# Altium project OBD-II-ELM327.PrjPcb
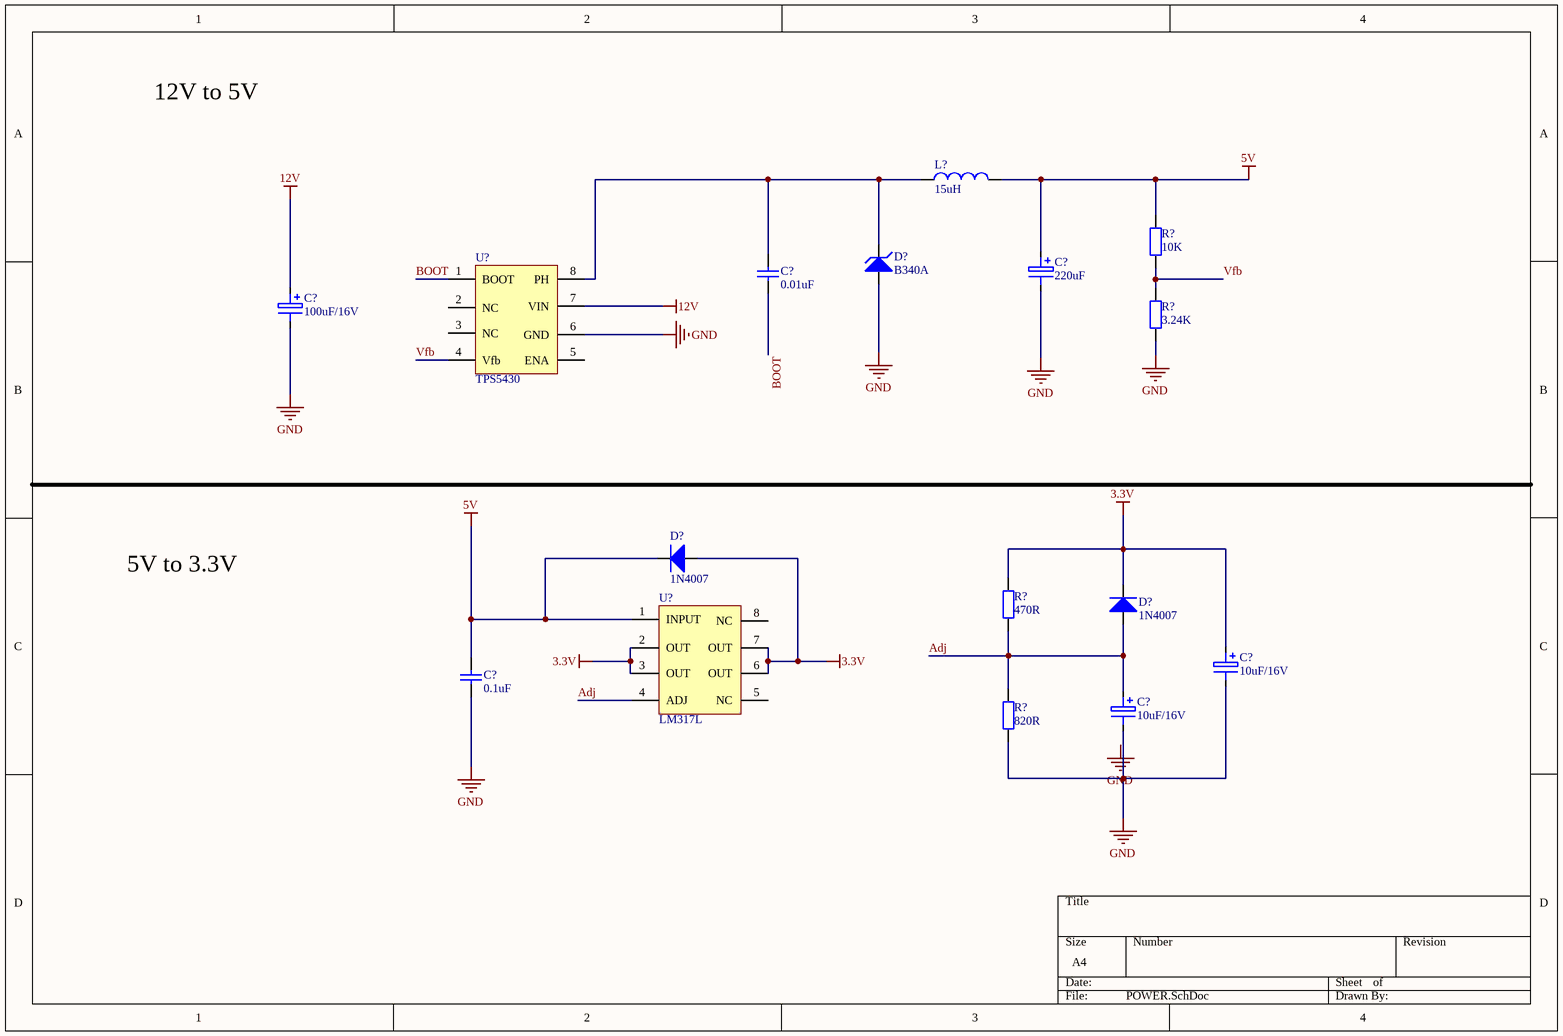
[diagram p0: POWER.SchDoc]
3 sheets, 47 parts. Net scope: global (net labels, ports and power ports of the same name join across sheets).
Board file: OBD-EML.PcbDoc
Sheets:
  POWER.SchDoc
  Core.SchDoc
  PL2303.SchDoc

## Sheet POWER.SchDoc
size A4

### Parts
(Parts that share a designator on the sheet are numbered #1, #2 ... from top to bottom, then left to right.)
C?#1  220uF  [CAPM-7.0*4.5]
C?#2  0.01uF  [0603]
C?#3  100uF/16V  [CAPM-7.0*4.5]
C?#4  10uF/16V  [CAPM-5.5*3.3]
C?#5  0.1uF  [0603]
C?#6  10uF/16V  [CAPM-5.5*3.3]
D?#1  B340A  [DO214-AC]
D?#2  1N4007  [DO214-AC]
D?#3  1N4007  [DO214-AC]
L?#1  15uH  [7*7*4-15uH]
R?#1  10K  [0603]
R?#2  3.24K  [0603]
R?#3  470R  [0603]
R?#4  820R  [0603]
U?#1  TPS5430  [TPS5430]
U?#2  LM317L  [LM317L]

### Nets
3.3V: C?#4.1 D?#2.1(A) D?#3.2(K) R?#3.2 U?#2.2(OUT) U?#2.3(OUT) U?#2.6(OUT) U?#2.7(OUT)
5V: C?#1.1 C?#5.2 D?#2.2(K) L?#1.2 R?#1.2 U?#2.1(INPUT)
12V: C?#3.1 U?#1.7(VIN)
GND: C?#1.2 C?#3.2 C?#4.2 C?#5.1 C?#6.2 D?#1.1(A) R?#2.1 R?#4.1 U?#1.6(GND)
Adj: C?#6.1 D?#3.1(A) R?#3.1 R?#4.2 U?#2.4(ADJ)
BOOT: C?#2.1 U?#1.1(BOOT)
Vfb: R?#1.1 R?#2.2 U?#1.4(Vfb)
NetC?#2_2: C?#2.2 D?#1.2(K) L?#1.1 U?#1.8(PH)

Not connected (* = marked no-connect by the designer): U?#1 2(NC) 3(NC) 5(ENA); U?#2 5(NC) 8(NC)

### Notes on the sheet
- 12V to 5V
- 5V to 3.3V
- Labels drawn without touching a wire or pin: GND

### Library data of the parts
C?#1 C?#3 C?#4 C?#6 = Cap3: aluminum
C?#2 C?#5 = Cap1: ceramic
D?#1 = B340A-13-F
L?#1 = Inductor
R?#1-R?#4 = Res

## Sheet Core.SchDoc
size A3
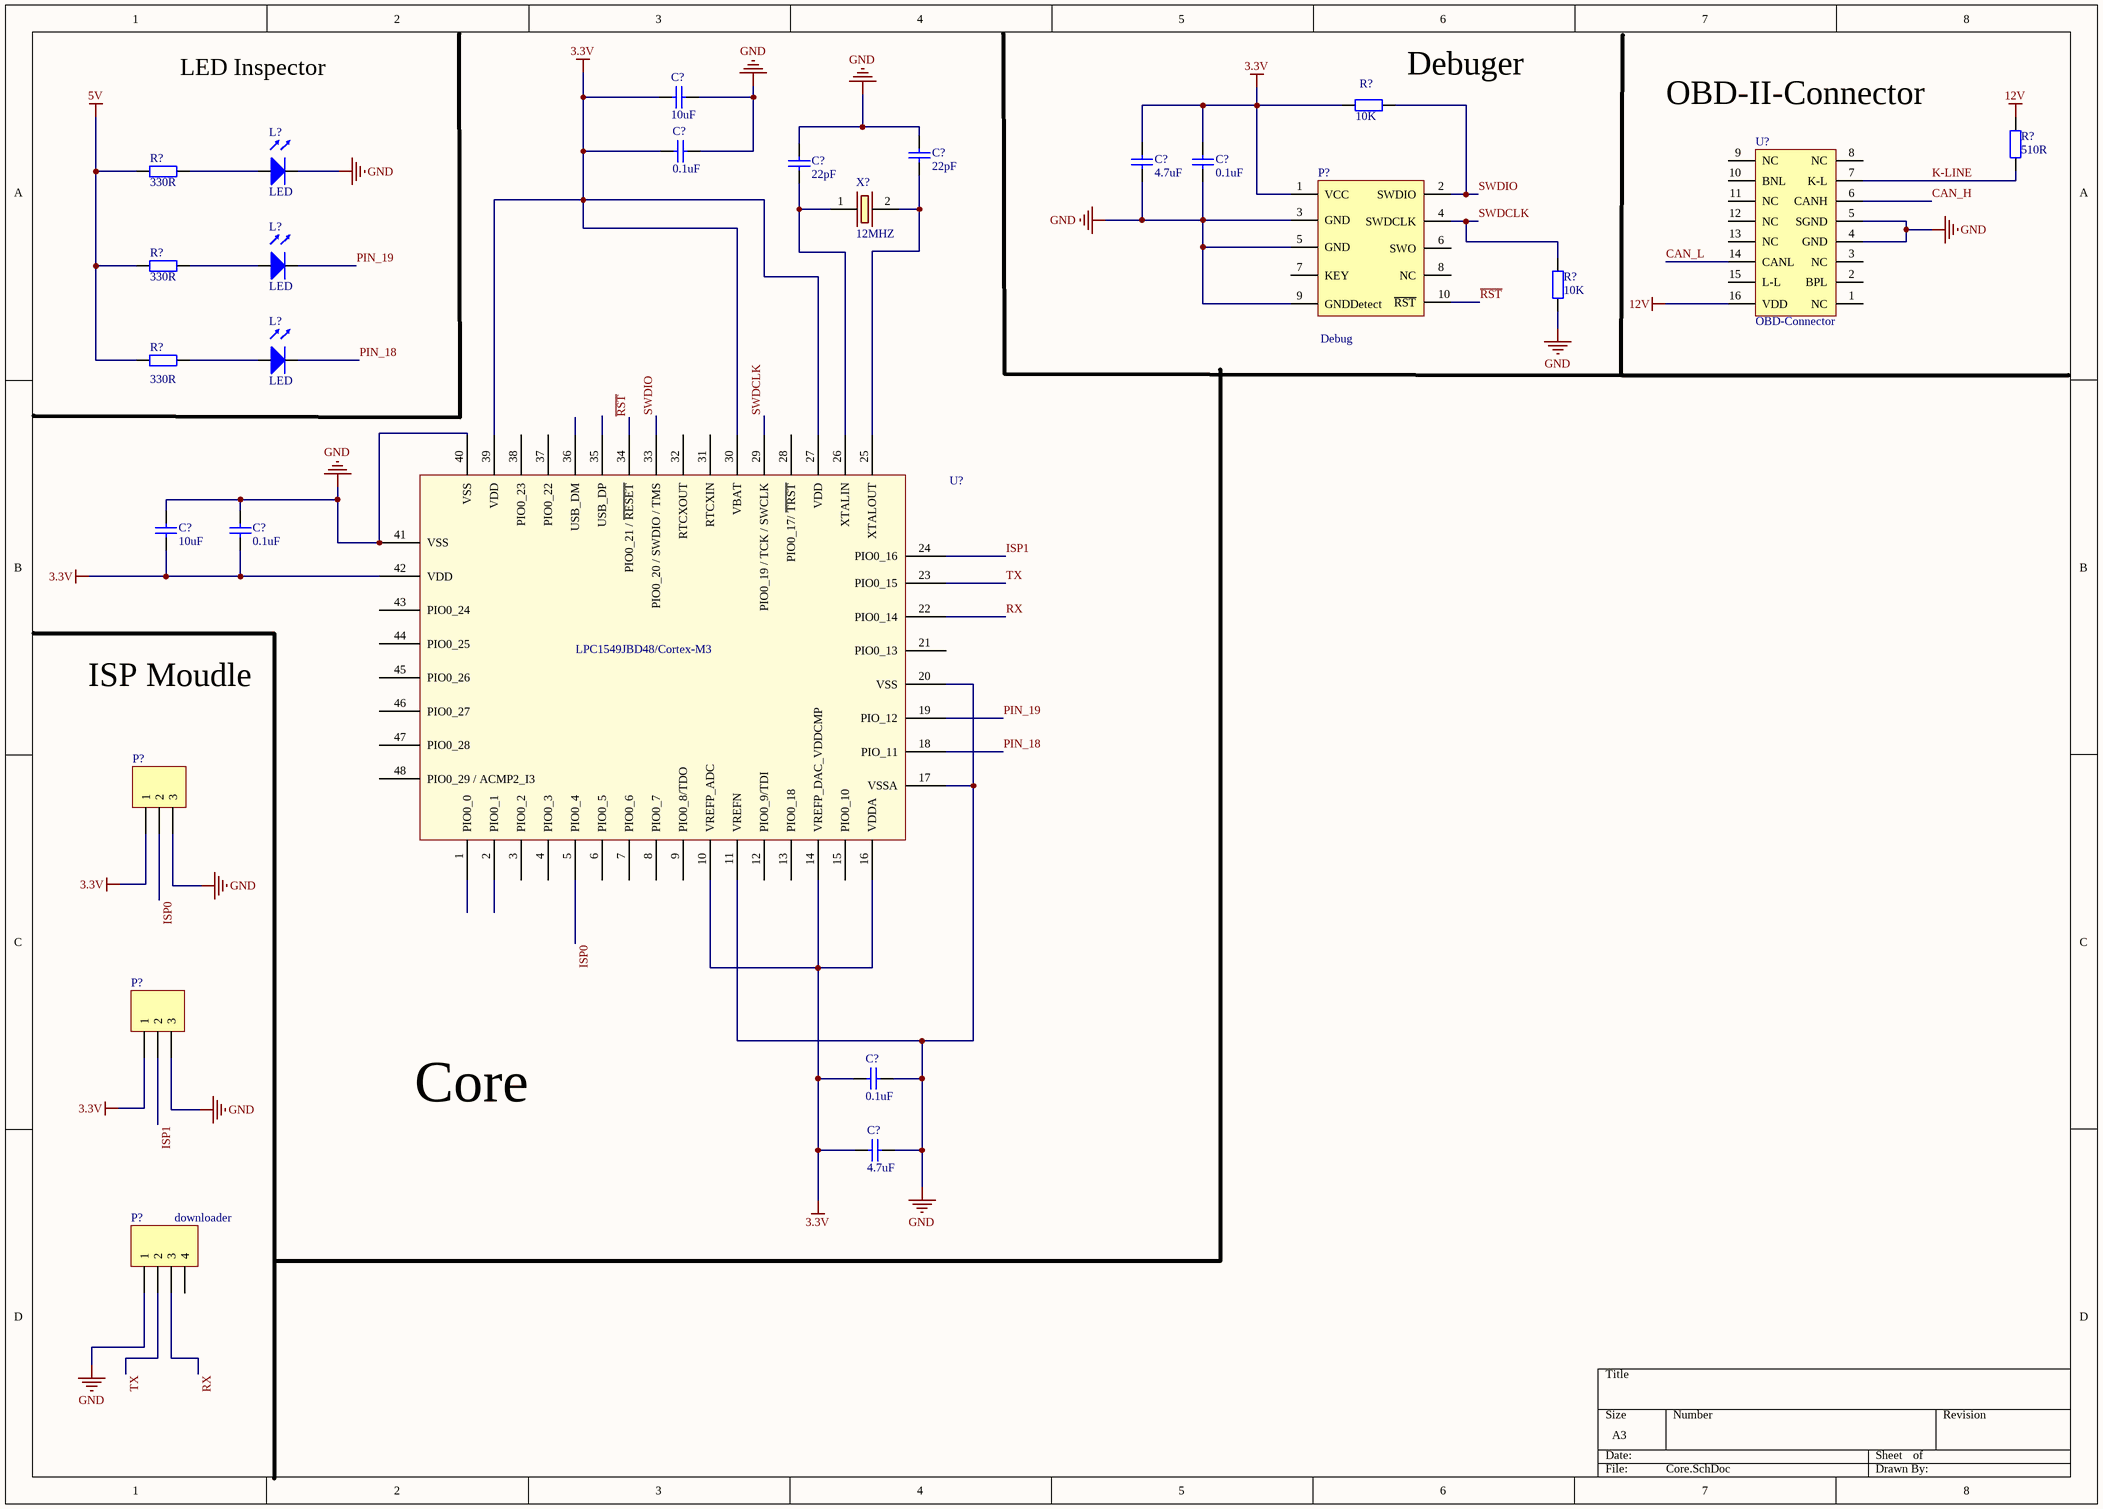
[diagram p1: Core.SchDoc]

### Parts
(Parts that share a designator on the sheet are numbered #1, #2 ... from top to bottom, then left to right.)
C?#7  10uF  [0603]
C?#8  0.1uF  [0603]
C?#9  22pF  [0603]
C?#10  22pF  [0603]
C?#11  4.7uF  [0603]
C?#12  0.1uF  [0603]
C?#13  10uF  [0603]
C?#14  0.1uF  [0603]
C?#15  0.1uF  [0603]
C?#16  4.7uF  [0603]
L?#2  LED  [0805]
L?#3  LED  [0805]
L?#4  LED  [0805]
P?#1  Debug  [JATG_10pin]
P?#2  (no value)  [HDR1X3]
P?#3  (no value)  [HDR1X3]
P?#4  downloader  [HDR1X4]
R?#5  10K  [0603]
R?#6  510R  [0603]
R?#7  330R  [0603]
R?#8  330R  [0603]
R?#9  10K  [0603]
R?#10  330R  [0603]
U?#3  OBD-Connector  [OBD-MaleConnector]
U?#4  LPC1549  [LPC1549JBD48]  (value not drawn)
X?  12MHZ  [12Mhz-DFN]

### Nets
3.3V: C?#7.2 C?#8.2 C?#11.2 C?#12.2 C?#13.1 C?#14.1 C?#15.2 C?#16.2 P?#1.1(VCC) P?#2.1 P?#3.1 R?#5.1 U?#4.10(VREFP_ADC) U?#4.14(VREFP_DAC_VDDCMP) U?#4.16(VDDA) U?#4.27(VDD) U?#4.30(VBAT) U?#4.39(VDD) U?#4.42(VDD)
5V: R?#7.1 R?#8.1 R?#10.1
12V: R?#6.2 U?#3.16(VDD)
GND: C?#7.1 C?#8.1 C?#9.2 C?#10.2 C?#11.1 C?#12.1 C?#13.2 C?#14.2 C?#15.1 C?#16.1 L?#2.2(K) P?#1.3(GND) P?#1.5(GND) P?#1.9(GNDDetect) P?#2.3 P?#3.3 P?#4.1 R?#9.1 U?#3.4(GND) U?#3.5(SGND) U?#4.11(VREFN) U?#4.17(VSSA) U?#4.20(VSS) U?#4.40(VSS) U?#4.41(VSS)
CAN_H: U?#3.6(CANH)
CAN_L: U?#3.14(CANL)
ISP0: P?#2.2 U?#4.5(PIO0_4)
ISP1: P?#3.2 U?#4.24(PIO0_16)
K-LINE: R?#6.1 U?#3.7(K-L)
PIN_18: L?#4.2(K) U?#4.18(PIO_11)
PIN_19: L?#3.2(K) U?#4.19(PIO_12)
~{RST}: P?#1.10(~{RST}) U?#4.34(PIO0_21_/_~{RESET})
RX: P?#4.3 U?#4.22(PIO0_14)
SWDCLK: P?#1.4(SWDCLK) R?#9.2 U?#4.29(PIO0_19_/_TCK_/_SWCLK)
SWDIO: P?#1.2(SWDIO) R?#5.2 U?#4.33(PIO0_20_/_SWDIO_/_TMS)
TX: P?#4.2 U?#4.23(PIO0_15)
NetC?#9_1: C?#9.1 U?#4.25(XTALOUT) X?.2
NetC?#10_1: C?#10.1 U?#4.26(XTALIN) X?.1
NetL?#2_1: L?#2.1(A) R?#7.2
NetL?#3_1: L?#3.1(A) R?#8.2
NetL?#4_1: L?#4.1(A) R?#10.2

Not connected (* = marked no-connect by the designer): P?#1 6(SWO) 7(KEY) 8(NC); P?#4 4; U?#3 1(NC) 2(BPL) 3(NC) 8(NC) 9(NC) 10(BNL) 11(NC) 12(NC) 13(NC) 15(L-L); U?#4 1(PIO0_0) 2(PIO0_1) 3(PIO0_2) 4(PIO0_3) 6(PIO0_5) 7(PIO0_6) 8(PIO0_7) 9(PIO0_8/TDO) 12(PIO0_9/TDI) 13(PIO0_18) 15(PIO0_10) 21(PIO0_13) 28(PIO0_17/_~{TRST}) 31(RTCXIN) 32(RTCXOUT) 35(USB_DP) 36(USB_DM) 37(PIO0_22) 38(PIO0_23) 43(PIO0_24) 44(PIO0_25) 45(PIO0_26) 46(PIO0_27) 47(PIO0_28) 48(PIO0_29_/_ACMP2_I3)

### Notes on the sheet
- LED Inspector
- (near R?#5) Debuger
- (near U?#3) OBD-II-Connector
- ISP Moudle
- Core
- (in symbol LPC1549JBD48) LPC1549JBD48/Cortex-M3

### Library data of the parts
C?#7-C?#16 = Cap1: ceramic
P?#1 = JTAG_10Pin
P?#2 P?#3 = Header 3: Header, 3-Pin; LatestRevisionDate: 17-Jul-2002; LatestRevisionNote: Re-released for DXP Platform.; Publisher: Altium Limited
P?#4 = Header 4: Header, 4-Pin; LatestRevisionDate: 17-Jul-2002; LatestRevisionNote: Re-released for DXP Platform.; Publisher: Altium Limited
R?#5-R?#10 = Res
U?#3 = OBD-MaleHead
U?#4 = LPC1549JBD48
X? = OSC

## Sheet PL2303.SchDoc
size A4
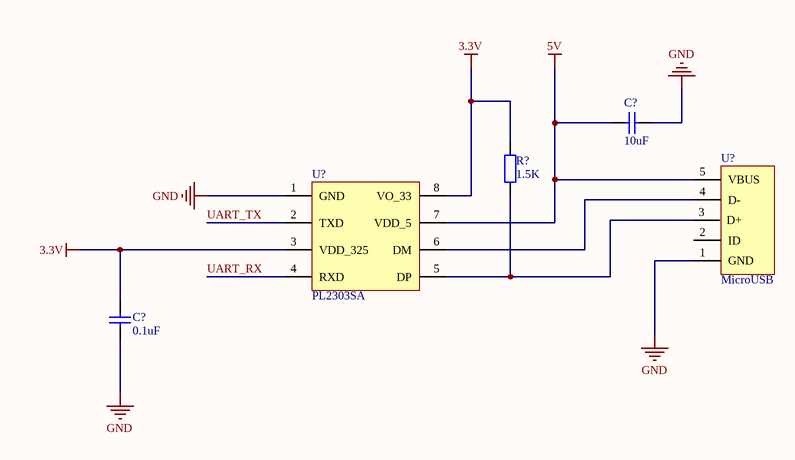
[diagram p2: PL2303.SchDoc]

### Parts
(Parts that share a designator on the sheet are numbered #1, #2 ... from top to bottom, then left to right.)
C?#17  10uF  [0603]
C?#18  0.1uF  [0603]
R?#11  1.5K  [0603]
U?#5  MicroUSB  [Micro-USB]
U?#6  PL2303SA  [SOP-8]

### Nets
3.3V: C?#18.2 R?#11.1 U?#6.3(VDD_325) U?#6.8(VO_33)
5V: C?#17.2 U?#5.5(VBUS) U?#6.7(VDD_5)
GND: C?#17.1 C?#18.1 U?#5.1(GND) U?#6.1(GND)
UART_RX: U?#6.4(RXD)
UART_TX: U?#6.2(TXD)
NetR?#11_2: R?#11.2 U?#5.3(D+) U?#6.5(DP)
NetU?#5_4: U?#5.4(D-) U?#6.6(DM)

Not connected (* = marked no-connect by the designer): U?#5 2(ID)

### Library data of the parts
C?#17 C?#18 = Cap1: ceramic
R?#11 = Res
U?#5 = MicroUSB_B

## Nets that join several sheets
3.3V: POWER (8 pins), Core (19 pins), PL2303 (C?#18.2 R?#11.1 U?#6.3 U?#6.8)
5V: POWER (6 pins), Core (R?#7.1 R?#8.1 R?#10.1), PL2303 (C?#17.2 U?#5.5 U?#6.7)
12V: POWER (C?#3.1 U?#1.7), Core (R?#6.2 U?#3.16)
GND: POWER (9 pins), Core (25 pins), PL2303 (C?#17.1 C?#18.1 U?#5.1 U?#6.1)